# EAGLE schematic GW01 (EAGLE 9.5.2)
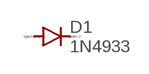
[diagram p0: schematic, sheet 1]

## Parts
D1  1N4933  [DO41-10]
Unconnected: D1.A D1.C

## Library data of the parts
D1 = diode:1N4933: DIODE fast recovery rectifier, 1A